# Altium schematic sheet Option_LPDDR2-32_168_BGA134.SchDoc
size 420 x 297 mm
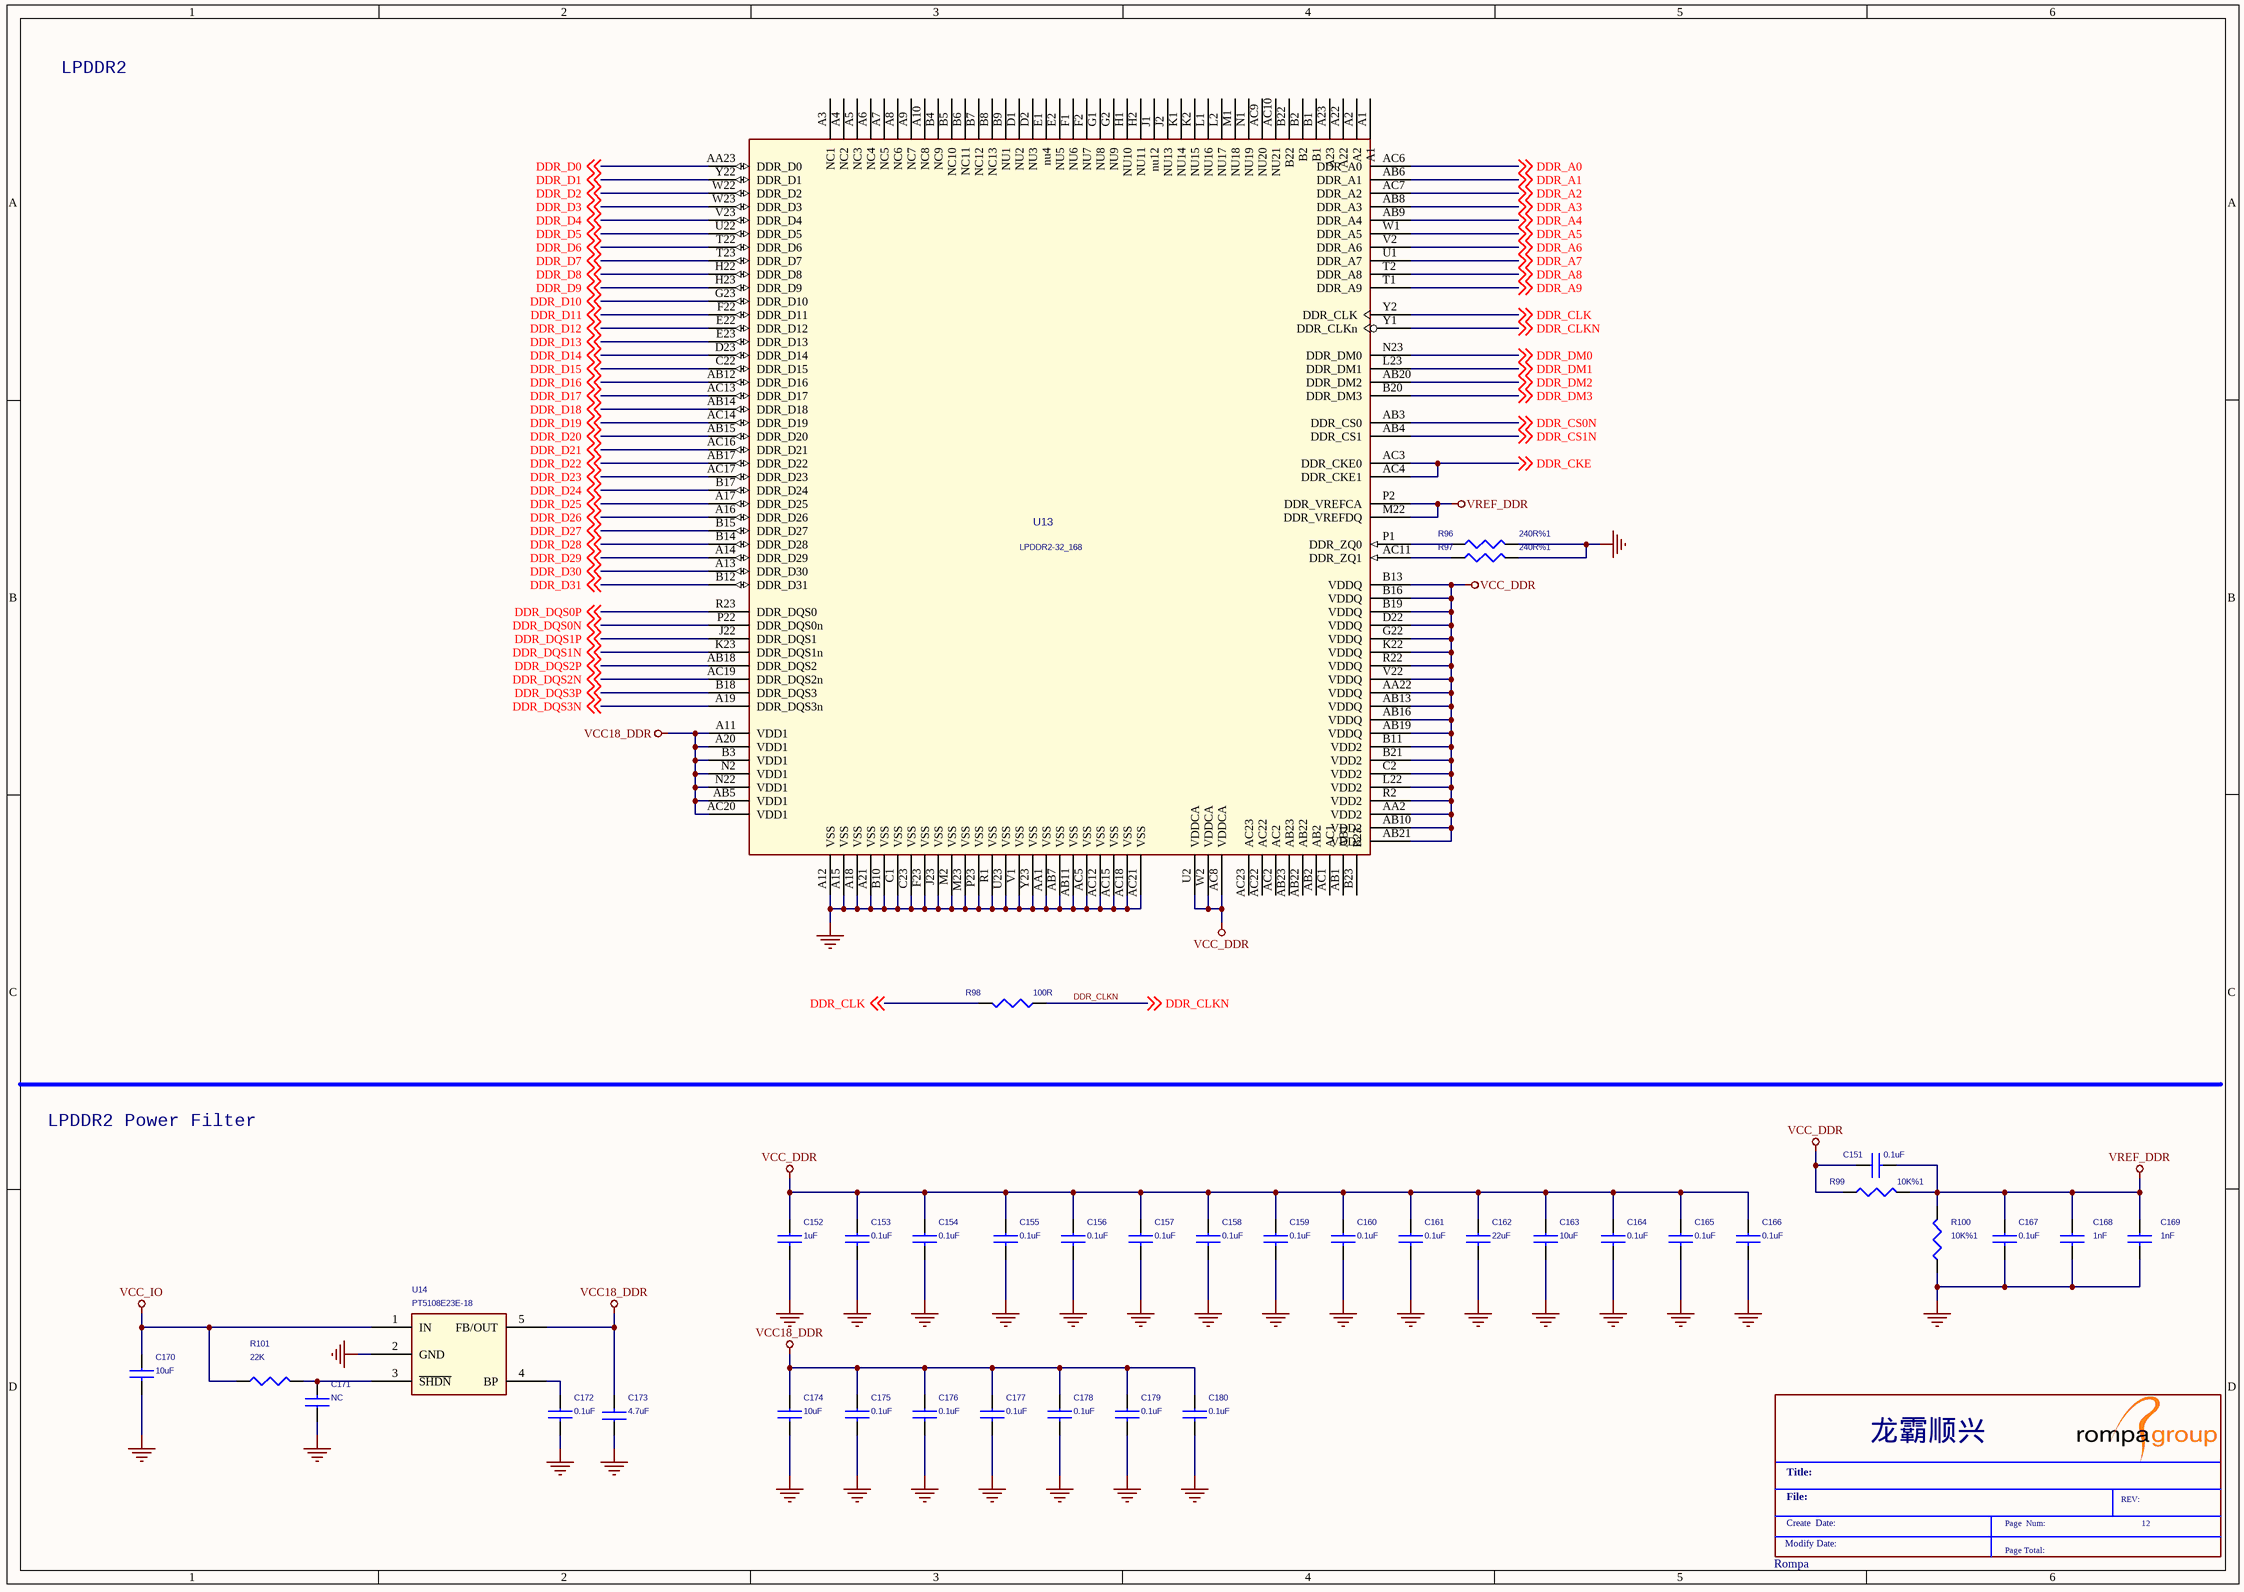
[diagram p0: Option_LPDDR2-32_168_BGA134.SchDoc]

## Parts
*  Rompa  Schematic Page Number: 12  (graphical)
C151  0.1uF  [C0402]
C152  1uF  [C0402]
C153  0.1uF  [C0402]
C154  0.1uF  [C0402]
C155  0.1uF  [C0402]
C156  0.1uF  [C0402]
C157  0.1uF  [C0402]
C158  0.1uF  [C0402]
C159  0.1uF  [C0402]
C160  0.1uF  [C0402]
C161  0.1uF  [C0402]
C162  22uF  [C0402]
C163  10uF  [C0402]
C164  0.1uF  [C0402]
C165  0.1uF  [C0402]
C166  0.1uF  [C0402]
C167  0.1uF  [C0402]
C168  1nF  [C0402]
C169  1nF  [C0402]
C170  10uF  [C0402]
C171  NC  [C0402]
C172  0.1uF  [C0402]
C173  4.7uF  [C0402]
C174  10uF  [C0402]
C175  0.1uF  [C0402]
C176  0.1uF  [C0402]
C177  0.1uF  [C0402]
C178  0.1uF  [C0402]
C179  0.1uF  [C0402]
C180  0.1uF  [C0402]
R96  240R%1  [R0402]
R97  240R%1  [R0402]
R98  100R  [R0402]
R99  10K%1  [R0402]
R100  10K%1  [R0402]
R101  22K  [R0402]
U13  LPDDR2-32_168  [BGA134]
U14  PT5108E23E-18  [SOT25]

## Nets
GND: C152.2 C153.2 C154.2 C155.2 C156.2 C157.2 C158.2 C159.2 C160.2 C161.2 C162.2 C163.2 C164.2 C165.2 C166.2 C167.2 C168.2 C169.2 C170.2 C171.1 C172.2 C173.1 C174.2 C175.2 C176.2 C177.2 C178.2 C179.2 C180.2 R96.2 R97.2 R100.1 U13.A12(VSS) U13.A15(VSS) U13.A18(VSS) U13.A21(VSS) U13.AA1(VSS) U13.AB7(VSS) U13.AB11(VSS) U13.AC5(VSS) U13.AC12(VSS) U13.AC15(VSS) U13.AC18(VSS) U13.AC21(VSS) U13.B10(VSS) U13.C1(VSS) U13.C23(VSS) U13.F23(VSS) U13.J23(VSS) U13.M2(VSS) U13.M23(VSS) U13.P23(VSS) U13.R1(VSS) U13.U23(VSS) U13.V1(VSS) U13.Y23(VSS) U14.2(GND)
VCC18_DDR: C173.2 C174.1 C175.1 C176.1 C177.1 C178.1 C179.1 C180.1 U13.A11(VDD1) U13.A20(VDD1) U13.AB5(VDD1) U13.AC20(VDD1) U13.B3(VDD1) U13.N2(VDD1) U13.N22(VDD1) U14.5(FB/OUT)
VCC_DDR: C151.1 C152.1 C153.1 C154.1 C155.1 C156.1 C157.1 C158.1 C159.1 C160.1 C161.1 C162.1 C163.1 C164.1 C165.1 C166.1 R99.1 U13.AA2(VDD2) U13.AA22(VDDQ) U13.AB10(VDD2) U13.AB13(VDDQ) U13.AB16(VDDQ) U13.AB19(VDDQ) U13.AB21(VDD2) U13.AC8(VDDCA) U13.B11(VDD2) U13.B13(VDDQ) U13.B16(VDDQ) U13.B19(VDDQ) U13.B21(VDD2) U13.C2(VDD2) U13.D22(VDDQ) U13.G22(VDDQ) U13.K22(VDDQ) U13.L22(VDD2) U13.R2(VDD2) U13.R22(VDDQ) U13.U2(VDDCA) U13.V22(VDDQ) U13.W2(VDDCA)
VCC_IO: C170.1 R101.1 U14.1(IN)
VREF_DDR: C151.2 C167.1 C168.1 C169.1 R99.2 R100.2 U13.M22(DDR_VREFDQ) U13.P2(DDR_VREFCA)
DDR_A0: U13.AC6(DDR_A0) ; off-sheet DDR_A0
DDR_A1: U13.AB6(DDR_A1) ; off-sheet DDR_A1
DDR_A2: U13.AC7(DDR_A2) ; off-sheet DDR_A2
DDR_A3: U13.AB8(DDR_A3) ; off-sheet DDR_A3
DDR_A4: U13.AB9(DDR_A4) ; off-sheet DDR_A4
DDR_A5: U13.W1(DDR_A5) ; off-sheet DDR_A5
DDR_A6: U13.V2(DDR_A6) ; off-sheet DDR_A6
DDR_A7: U13.U1(DDR_A7) ; off-sheet DDR_A7
DDR_A8: U13.T2(DDR_A8) ; off-sheet DDR_A8
DDR_A9: U13.T1(DDR_A9) ; off-sheet DDR_A9
DDR_CKE: U13.AC3(DDR_CKE0) U13.AC4(DDR_CKE1) ; off-sheet DDR_CKE
DDR_CLK: R98.2 U13.Y2(DDR_CLK) ; off-sheet DDR_CLK
DDR_CLKN: R98.1 U13.Y1(DDR_CLKn) ; off-sheet DDR_CLKN
DDR_CS0N: U13.AB3(DDR_CS0) ; off-sheet DDR_CS0N
DDR_CS1N: U13.AB4(DDR_CS1) ; off-sheet DDR_CS1N
DDR_D0: U13.AA23(DDR_D0) ; off-sheet DDR_D0
DDR_D1: U13.Y22(DDR_D1) ; off-sheet DDR_D1
DDR_D2: U13.W22(DDR_D2) ; off-sheet DDR_D2
DDR_D3: U13.W23(DDR_D3) ; off-sheet DDR_D3
DDR_D4: U13.V23(DDR_D4) ; off-sheet DDR_D4
DDR_D5: U13.U22(DDR_D5) ; off-sheet DDR_D5
DDR_D6: U13.T22(DDR_D6) ; off-sheet DDR_D6
DDR_D7: U13.T23(DDR_D7) ; off-sheet DDR_D7
DDR_D8: U13.H22(DDR_D8) ; off-sheet DDR_D8
DDR_D9: U13.H23(DDR_D9) ; off-sheet DDR_D9
DDR_D10: U13.G23(DDR_D10) ; off-sheet DDR_D10
DDR_D11: U13.F22(DDR_D11) ; off-sheet DDR_D11
DDR_D12: U13.E22(DDR_D12) ; off-sheet DDR_D12
DDR_D13: U13.E23(DDR_D13) ; off-sheet DDR_D13
DDR_D14: U13.D23(DDR_D14) ; off-sheet DDR_D14
DDR_D15: U13.C22(DDR_D15) ; off-sheet DDR_D15
DDR_D16: U13.AB12(DDR_D16) ; off-sheet DDR_D16
DDR_D17: U13.AC13(DDR_D17) ; off-sheet DDR_D17
DDR_D18: U13.AB14(DDR_D18) ; off-sheet DDR_D18
DDR_D19: U13.AC14(DDR_D19) ; off-sheet DDR_D19
DDR_D20: U13.AB15(DDR_D20) ; off-sheet DDR_D20
DDR_D21: U13.AC16(DDR_D21) ; off-sheet DDR_D21
DDR_D22: U13.AB17(DDR_D22) ; off-sheet DDR_D22
DDR_D23: U13.AC17(DDR_D23) ; off-sheet DDR_D23
DDR_D24: U13.B17(DDR_D24) ; off-sheet DDR_D24
DDR_D25: U13.A17(DDR_D25) ; off-sheet DDR_D25
DDR_D26: U13.A16(DDR_D26) ; off-sheet DDR_D26
DDR_D27: U13.B15(DDR_D27) ; off-sheet DDR_D27
DDR_D28: U13.B14(DDR_D28) ; off-sheet DDR_D28
DDR_D29: U13.A14(DDR_D29) ; off-sheet DDR_D29
DDR_D30: U13.A13(DDR_D30) ; off-sheet DDR_D30
DDR_D31: U13.B12(DDR_D31) ; off-sheet DDR_D31
DDR_DM0: U13.N23(DDR_DM0) ; off-sheet DDR_DM0
DDR_DM1: U13.L23(DDR_DM1) ; off-sheet DDR_DM1
DDR_DM2: U13.AB20(DDR_DM2) ; off-sheet DDR_DM2
DDR_DM3: U13.B20(DDR_DM3) ; off-sheet DDR_DM3
DDR_DQS0N: U13.P22(DDR_DQS0n) ; off-sheet DDR_DQS0N
DDR_DQS0P: U13.R23(DDR_DQS0) ; off-sheet DDR_DQS0P
DDR_DQS1N: U13.K23(DDR_DQS1n) ; off-sheet DDR_DQS1N
DDR_DQS1P: U13.J22(DDR_DQS1) ; off-sheet DDR_DQS1P
DDR_DQS2N: U13.AC19(DDR_DQS2n) ; off-sheet DDR_DQS2N
DDR_DQS2P: U13.AB18(DDR_DQS2) ; off-sheet DDR_DQS2P
DDR_DQS3N: U13.A19(DDR_DQS3n) ; off-sheet DDR_DQS3N
DDR_DQS3P: U13.B18(DDR_DQS3) ; off-sheet DDR_DQS3P
NetC171_2: C171.2 R101.2 U14.3(~{SHDN})
NetC172_1: C172.1 U14.4(BP)
NetR96_1: R96.1 U13.P1(DDR_ZQ0)
NetR97_1: R97.1 U13.AC11(DDR_ZQ1)

Not connected (* = marked no-connect by the designer): U13 A1 A2 A3(NC1) A4(NC2) A5(NC3) A6(NC4) A7(NC5) A8(NC6) A9(NC7) A10(NC8) A22 A23 AB1 AB2 AB22 AB23 AC1 AC2 AC9(NU20) AC10(NU21) AC22 AC23 B1 B2 B4(NC9) B5(NC10) B6(NC11) B7(NC12) B8(NC13) B9(NU1) B22 B23 D1(NU2) D2(NU3) E1(nu4) E2(NU5) F1(NU6) F2(NU7) G1(NU8) G2(NU9) H1(NU10) H2(NU11) J1(nu12) J2(NU13) K1(NU14) K2(NU15) L1(NU16) L2(NU17) M1(NU18) N1(NU19)

## Notes on the sheet
- LPDDR2
- LPDDR2 Power Filter
- (in symbol Rompa) 龙霸顺兴; Title:; File:; REV:; Create  Date:; Page  Num:; Modify Date:; Page Total:

## Library data of the parts
C151 C167-C169 = CAP NP_0
C152 C153 C174 = CAP NP: RoHS CHIP CAP 1uF +10/-10% X5R
C154-C166 C175-C180 = CAP NP: RoHS CHIP CAP 0.1uF +10/-10% X7R
C170 = CAP NP: CAP,MLCC,22uF,+/-10%,X5R,6.3V,SMD1206
C171 = CAP NP
C172 = CAP NP: CAP,MLCC,100nF,+/-10%,X7R,6.3V,SMD0402
C173 = CAP NP: CAP,MLCC,10uF,+/-10%,X5R,6.3V,SMD0805
R96 R97 R99 R100 = RESISTOR_0: 贴片电阻
R98 = RESISTOR: NC/ROHS CHIP RES 100R 1/16W 5%
R101 = RES 1B
U13 = LPDDR2-32_2
U14 = DS8008_4: LDO,PT5108E23E-18,VINmax=5.5V,Vout=1.8V,+/-2%,500mA,SOT-23-5